# Altium project Transmitter - Student Version.PrjPcb
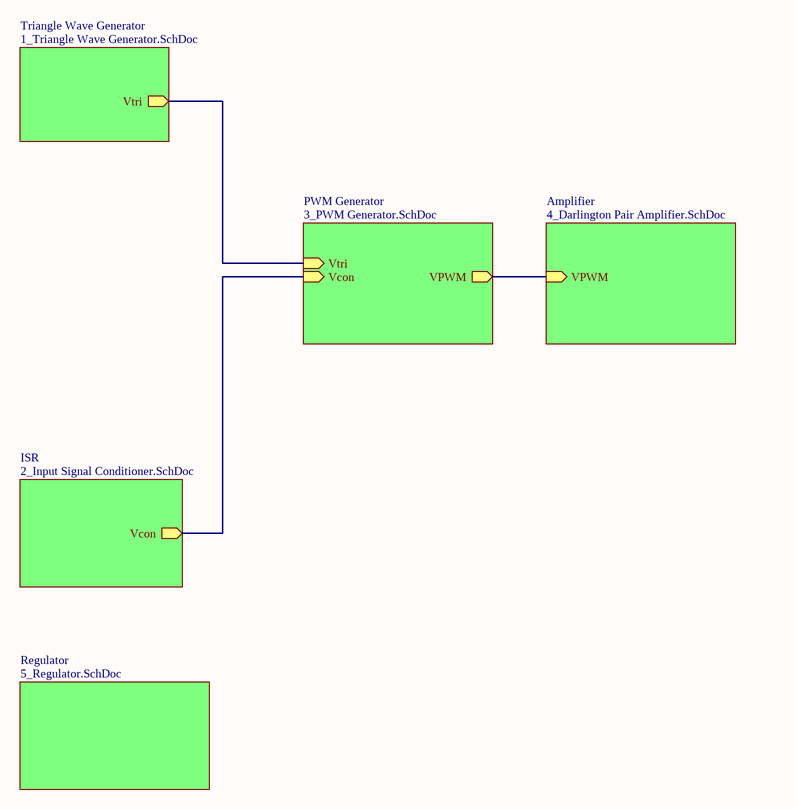
[diagram p0: Transmitter.SchDoc]
6 sheets, 46 parts. Net scope: hierarchical (ports join the sheet entries above them; power ports are global).
Board file: Transmitter.PcbDoc
Sheets:
  Transmitter.SchDoc
    Triangle Wave Generator = 1_Triangle Wave Generator.SchDoc
    ISR = 2_Input Signal Conditioner.SchDoc
    PWM Generator = 3_PWM Generator.SchDoc
    Amplifier = 4_Darlington Pair Amplifier.SchDoc
    Regulator = 5_Regulator.SchDoc

## Sheet Transmitter.SchDoc
size A4; SheetNumber: 1; SheetTotal: 6

### Sub-sheets
Amplifier = 4_Darlington Pair Amplifier.SchDoc: VPWM (in)
ISR = 2_Input Signal Conditioner.SchDoc: Vcon (out)
PWM Generator = 3_PWM Generator.SchDoc: Vcon (in), Vtri (in), VPWM (out)
Regulator = 5_Regulator.SchDoc: no entries
Triangle Wave Generator = 1_Triangle Wave Generator.SchDoc: Vtri (out)

### Nets
NetC1_2: sheet Triangle Wave Generator/Vtri, sheet PWM Generator/Vtri
NetQ?#1_2: sheet PWM Generator/VPWM, sheet Amplifier/VPWM
NetR13_2: sheet ISR/Vcon, sheet PWM Generator/Vcon

## Sheet 1_Triangle Wave Generator.SchDoc
size A4; SheetNumber: 6; SheetTotal: 6
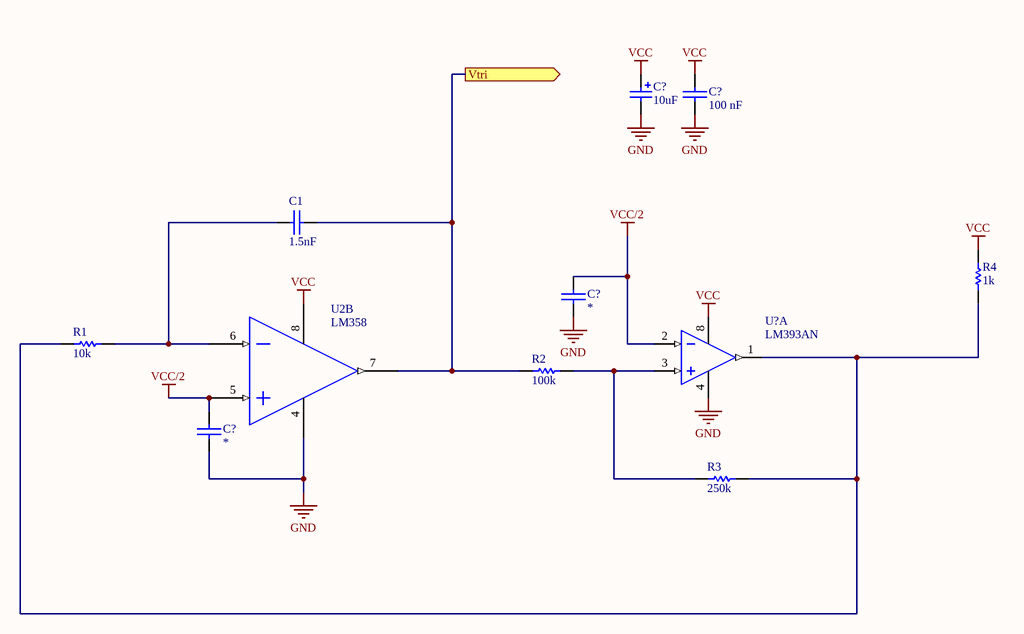
[diagram p1: 1_Triangle Wave Generator.SchDoc]

### Parts
(Parts that share a designator on the sheet are numbered #1, #2 ... from top to bottom, then left to right.)
C1  1.5nF  [ece-RAD0.2]
C?#1  10uF  [ece-CAPAD2TH0.3]
C?#2  100 nF  [ece-RAD0.2]
C?#3  *  [ece-RAD0.2]
C?#4  *  [ece-RAD0.2]
R1  10k  [ece-AXIAL0.4]
R2  100k  [ece-AXIAL0.4]
R3  250k  [ece-AXIAL0.4]
R4  1k  [ece-AXIAL0.4]
U2  LM358  [ECE-DIP8]  (part B of 2)
U?#1  LM393AN  [ECE-DIP8]  (part A of 2)

### Ports
Vtri (out)

### Nets
GND: C?#1.2 C?#2.2 C?#3.1 C?#4.1 U2.4(GND) U?#1.4(GND)
VCC: C?#1.1 C?#2.1 R4.2 U2.8(V(+)) U?#1.8(V+)
VCC/2: C?#3.2 C?#4.2 U2.5(IN2(+)) U?#1.2(IN-)
NetC1_1: C1.1 R1.2 U2.6(IN2(-))
NetC1_2: C1.2 R2.1 U2.7(OUT2) ; port Vtri
NetR1_1: R1.1 R3.2 R4.1 U?#1.1(OUT)
NetR2_2: R2.2 R3.1 U?#1.3(IN+)

### Library data of the parts
C1 C?#2-C?#4 = CAP: Capacitor Non Polarised Through Hole
  C1 C?#3 C?#4: Value: *
  C?#2: Value: 100 nF
C?#1 = CAP 22uF TH: Polarized Capacitor (Radial); Manufacturer: Generic Components; Class I: Passive; Published: 8-Jun-2000; Revision: July-2002: Re-released for DXP Platform.; Publisher: Altium Limited; Class II: Capacitor; Value: 10uF
R1-R4 = Res1: Resistor; Published: 8-Jun-2000; LatestRevisionDate: 17-Jul-2002; LatestRevisionNote: Re-released for DXP Platform.; PackageReference: AXIAL-0.3; Publisher: Altium Limited; Value: *
U2 = TLC082
U?#1 = LM393AN: Dual Comparator; Published: 17-Jul-2002; LatestRevisionDate: 06-Jun-2005; LatestRevisionNote: Stylized 3D Model Added.; DatasheetVersion: 1988; PackageReference: 626-05; Publisher: Altium Limited; PackageDescription: DIP; 8 Leads; Row Spacing 7.62 mm; Pitch 2.54 mm; ComponentLink1Description: Manufacturer Link; ComponentLink1URL: http://www.onsemi.com/site/products/taxonomy/0,4438,133,00.html

## Sheet 2_Input Signal Conditioner.SchDoc
size A4; SheetNumber: 2; SheetTotal: 5
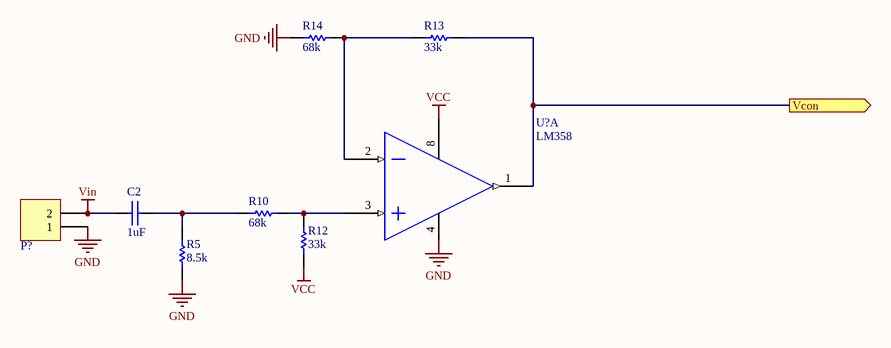
[diagram p2: 2_Input Signal Conditioner.SchDoc]

### Parts
(Parts that share a designator on the sheet are numbered #1, #2 ... from top to bottom, then left to right.)
C2  1uF  [ece-RAD0.2]
P?#1  Header 2  [ece-TER2-10MM]  (value not drawn)
R5  8.5k  [ece-AXIAL0.4]
R10  68k  [ece-AXIAL0.4]
R12  33k  [ece-AXIAL0.4]
R13  33k  [ece-AXIAL0.4]
R14  68k  [ece-AXIAL0.4]
U?#2  LM358  [ECE-DIP8]  (part A of 2)

### Ports
Vcon (out)

### Nets
GND: P?#1.1 R5.1 R14.1
VCC: R12.1 U?#2.8(V(+))
Vin: C2.1 P?#1.2
NetC2_2: C2.2 R5.2 R10.1
NetR10_2: R10.2 R12.2 U?#2.3(IN1(+))
NetR13_1: R13.1 R14.2 U?#2.2(IN1(-))
NetR13_2: R13.2 U?#2.1(OUT1) ; port Vcon

Not connected (* = marked no-connect by the designer): U?#2 4(GND)

### Notes on the sheet
- Labels drawn without touching a wire or pin: GND

### Library data of the parts
C2 = CAP: Capacitor Non Polarised Through Hole; Value: *
P?#1 = TERMINAL 2: Large 2 way screw connector
R5 R10 R12-R14 = Res1: Resistor; Published: 8-Jun-2000; LatestRevisionDate: 17-Jul-2002; LatestRevisionNote: Re-released for DXP Platform.; PackageReference: AXIAL-0.3; Publisher: Altium Limited; Value: *
U?#2 = TLC082: Value: TLC082

## Sheet 3_PWM Generator.SchDoc
size A4; SheetNumber: 4; SheetTotal: 6
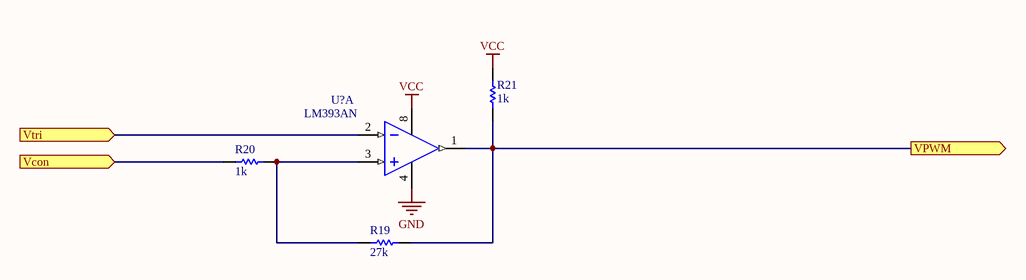
[diagram p3: 3_PWM Generator.SchDoc]

### Parts
(Parts that share a designator on the sheet are numbered #1, #2 ... from top to bottom, then left to right.)
R19  27k  [ece-AXIAL0.4]
R20  1k  [ece-AXIAL0.4]
R21  1k  [ece-AXIAL0.4]
U?#3  LM393AN  [ECE-DIP8]  (part A of 2)

### Ports
Vcon (in), VPWM (out), Vtri (in)

### Nets
GND: U?#3.4(GND)
VCC: R21.1 U?#3.8(V+)
NetC1_2: U?#3.2(IN-) ; port Vtri
NetQ?#1_2: R19.2 R21.2 U?#3.1(OUT) ; port VPWM
NetR13_2: R20.1 ; port Vcon
NetR19_1: R19.1 R20.2 U?#3.3(IN+)

### Library data of the parts
R19-R21 = Res1: Resistor; Published: 8-Jun-2000; LatestRevisionDate: 17-Jul-2002; LatestRevisionNote: Re-released for DXP Platform.; PackageReference: AXIAL-0.3; Publisher: Altium Limited; Value: *
U?#3 = LM393AN: Dual Comparator; Published: 17-Jul-2002; LatestRevisionDate: 06-Jun-2005; LatestRevisionNote: Stylized 3D Model Added.; DatasheetVersion: 1988; PackageReference: 626-05; Publisher: Altium Limited; PackageDescription: DIP; 8 Leads; Row Spacing 7.62 mm; Pitch 2.54 mm; ComponentLink1Description: Manufacturer Link; ComponentLink1URL: http://www.onsemi.com/site/products/taxonomy/0,4438,133,00.html

## Sheet 4_Darlington Pair Amplifier.SchDoc
size A4; SheetNumber: 5; SheetTotal: 6
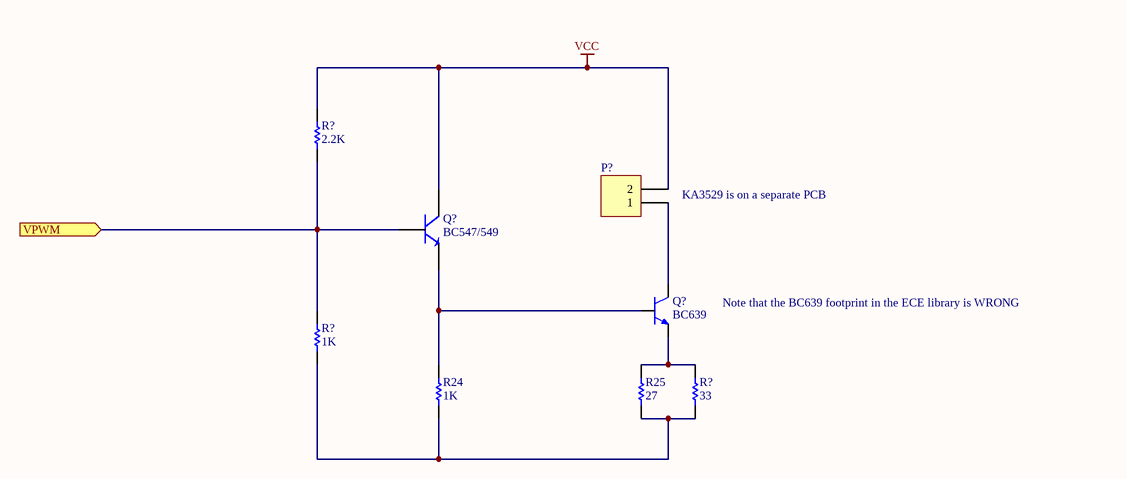
[diagram p4: 4_Darlington Pair Amplifier.SchDoc]

### Parts
(Parts that share a designator on the sheet are numbered #1, #2 ... from top to bottom, then left to right.)
P?#2  Header 2  [ece-HDR1X2]  (value not drawn)
Q?#1  BC547/549  [ece-TO-92Z]
Q?#2  BC639  [TO92]
R24  1K  [ece-AXIAL0.4]
R25  27  [ece-AXIAL0.4]
R?#1  2.2K  [ece-AXIAL0.4]
R?#2  1K  [ece-AXIAL0.4]
R?#3  33  [ece-AXIAL0.4]

### Ports
VPWM (in)

### Nets
VCC: P?#2.2 Q?#1.1(C) R?#1.2
NetP?#2_1: P?#2.1 Q?#2.2
NetQ?#1_2: Q?#1.2(B) R?#1.1 R?#2.2 ; port VPWM
NetQ?#1_3: Q?#1.3(E) Q?#2.3 R24.2
NetQ?#2_1: Q?#2.1 R25.2 R?#3.2
NetR24_1: R24.1 R25.1 R?#2.1 R?#3.1

### Notes on the sheet
- (near P?#2) KA3529 is on a separate PCB
- Note that the BC639 footprint in the ECE library is WRONG

### Library data of the parts
P?#2 = Header 2: Header, 2-Pin; LatestRevisionDate: 17-Jul-2002; LatestRevisionNote: Re-released for DXP Platform.; Publisher: Altium Limited
Q?#1 = BC547/549: NPN Transistor; Value: BC547/549
Q?#2 = BC639: BC639 with correct footprint
R24 R25 R?#1-R?#3 = Res1: Resistor; Published: 8-Jun-2000; LatestRevisionDate: 17-Jul-2002; LatestRevisionNote: Re-released for DXP Platform.; PackageReference: AXIAL-0.3; Publisher: Altium Limited; Value: *

## Sheet 5_Regulator.SchDoc
size A4; SheetNumber: 6; SheetTotal: 6
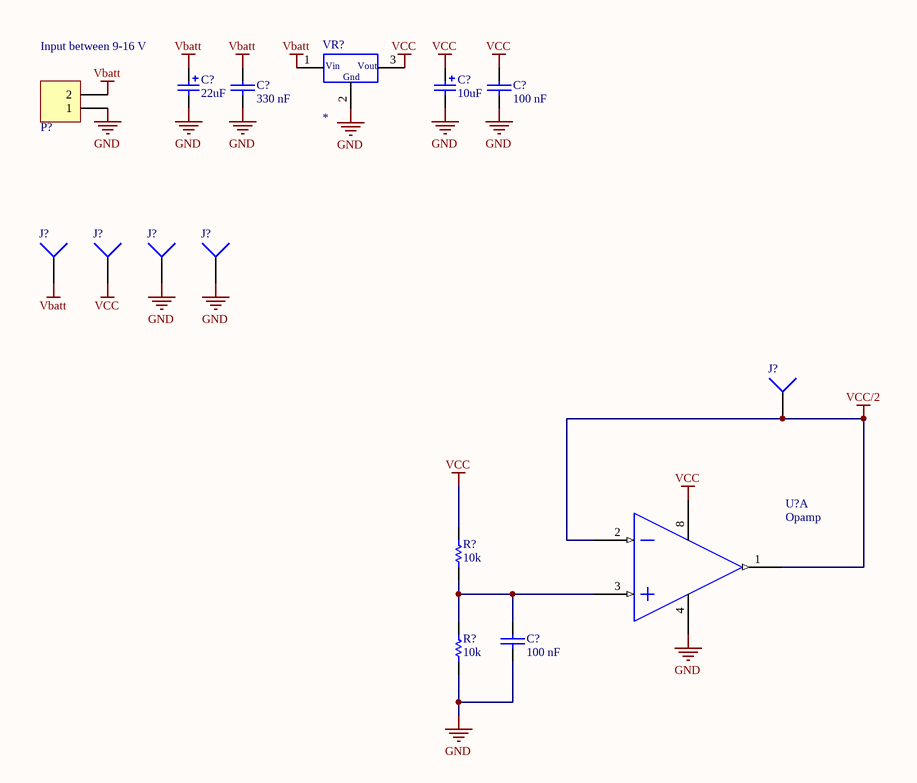
[diagram p5: 5_Regulator.SchDoc]

### Parts
(Parts that share a designator on the sheet are numbered #1, #2 ... from top to bottom, then left to right.)
C?#5  22uF  [ece-CAPAD2TH0.3]
C?#6  330 nF  [ece-RAD0.2]
C?#7  10uF  [ece-CAPAD2TH0.3]
C?#8  100 nF  [ece-RAD0.2]
C?#9  100 nF  [ece-RAD0.2]
J?#1  Vbatt  [ece-HDR1]  (value not drawn)
J?#2  Vcc  [ece-HDR1]  (value not drawn)
J?#3  GND  [ece-HDR1]  (value not drawn)
J?#4  GND  [ece-HDR1]  (value not drawn)
J?#5  Vcc/2  [ece-HDR1]  (value not drawn)
P?#3  Header 2  [ece-TER2-10MM]  (value not drawn)
R?#4  10k  [ece-AXIAL0.4]
R?#5  10k  [ece-AXIAL0.4]
U?#4  Opamp  [ECE-DIP8]  (part A of 2)
VR?  *  [ece-TO220]

### Nets
GND: C?#5.2 C?#6.2 C?#7.2 C?#8.2 C?#9.2 J?#3.1 J?#4.1 P?#3.1 R?#5.1 U?#4.4(GND) VR?.2(Gnd)
Vbatt: C?#5.1 C?#6.1 J?#1.1 P?#3.2 VR?.1(Vin)
VCC: C?#7.1 C?#8.1 J?#2.1 R?#4.2 U?#4.8(V(+)) VR?.3(Vout)
VCC/2: J?#5.1 U?#4.1(OUT1) U?#4.2(IN1(-))
NetC?#9_1: C?#9.1 R?#4.1 R?#5.2 U?#4.3(IN1(+))

### Notes on the sheet
- Input between 9-16 V

### Library data of the parts
C?#5 C?#7 = CAP 22uF TH: as C?#1 on sheet 1_Triangle Wave Generator; Published: 8-Jun-2000; Revision: July-2002: Re-released for DXP Platform.; Publisher: Altium Limited; Class II: Capacitor
  C?#5: Value: 22uF
  C?#7: Value: 10uF
C?#6 C?#8 C?#9 = CAP: Capacitor Non Polarised Through Hole
  C?#6: Value: 330 nF
  C?#8 C?#9: Value: 100 nF
J?#1-J?#5 = Test pin: Socket; LatestRevisionDate: 17-Jul-2002; LatestRevisionNote: Re-released for DXP Platform.; Publisher: Altium Limited
P?#3 = TERMINAL 2: Large 2 way screw connector
R?#4 R?#5 = Res1: Resistor; Published: 8-Jun-2000; LatestRevisionDate: 17-Jul-2002; LatestRevisionNote: Re-released for DXP Platform.; PackageReference: AXIAL-0.3; Publisher: Altium Limited; Value: 10k
U?#4 = TLC082
VR? = VoltRegBig: Voltage Regulator; Value: *

## Nets that join several sheets
GND: 1_Triangle Wave Generator (6 pins), 2_Input Signal Conditioner (P?#1.1 R5.1 R14.1), 3_PWM Generator (U?#3.4), 5_Regulator (11 pins)
VCC: 1_Triangle Wave Generator (5 pins), 2_Input Signal Conditioner (R12.1 U?#2.8), 3_PWM Generator (R21.1 U?#3.8), 4_Darlington Pair Amplifier (P?#2.2 Q?#1.1 R?#1.2), 5_Regulator (6 pins)
VCC/2: 1_Triangle Wave Generator (C?#3.2 C?#4.2 U2.5 U?#1.2), 5_Regulator (J?#5.1 U?#4.1 U?#4.2)
NetC1_2: 1_Triangle Wave Generator (C1.2 R2.1 U2.7), 3_PWM Generator (U?#3.2)
NetQ?#1_2: 3_PWM Generator (R19.2 R21.2 U?#3.1), 4_Darlington Pair Amplifier (Q?#1.2 R?#1.1 R?#2.2)
NetR13_2: 2_Input Signal Conditioner (R13.2 U?#2.1), 3_PWM Generator (R20.1)